# EAGLE design Adaptadora_AVR-Mega-U4_44pin (EAGLE 6.5.0)
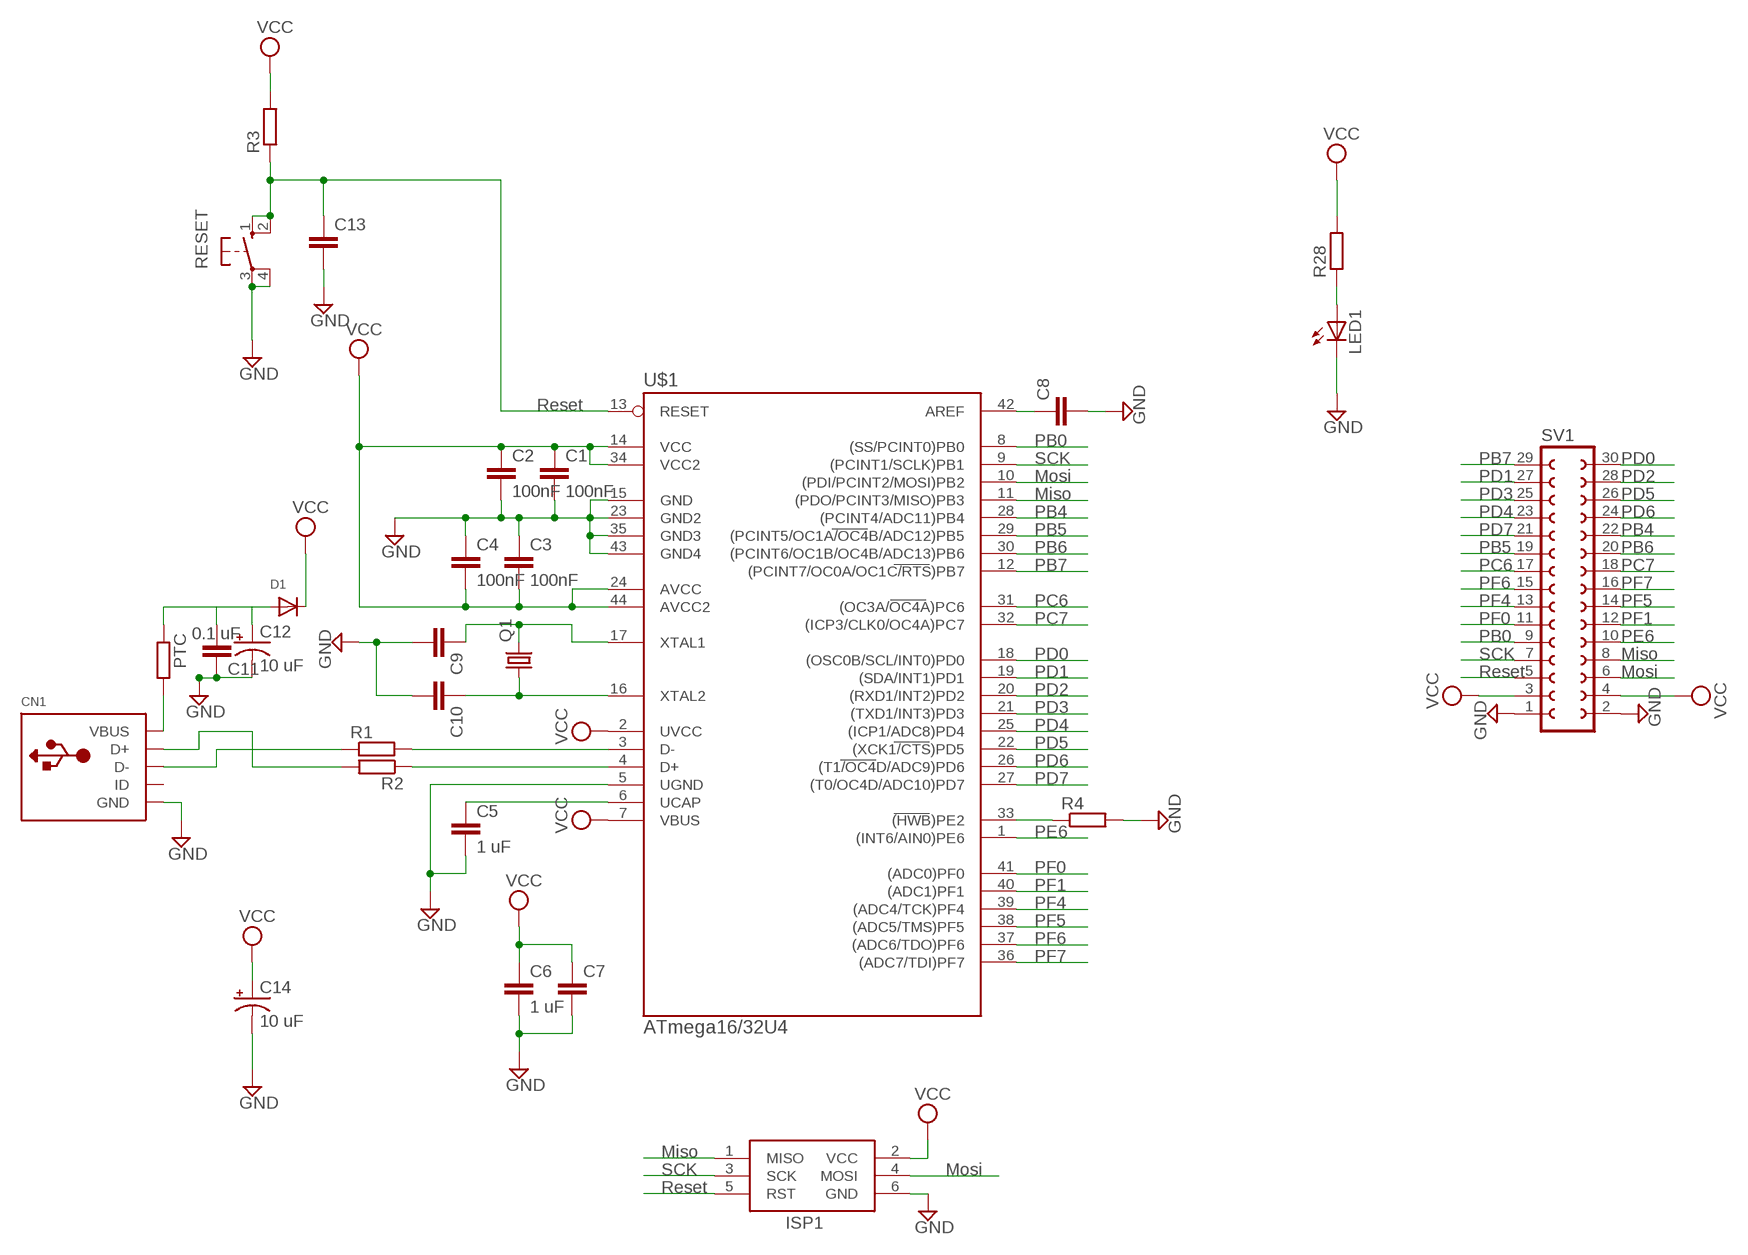
[diagram p0: schematic, sheet 1]

## Parts
C1  100nF  C-EUC1206  [C1206]
C2  100nF  C-EUC1206  [C1206]
C3  100nF  C-EUC1206  [C1206]
C4  100nF  C-EUC1206  [C1206]
C5  1 uF  C-EUC1206  [C1206]
C6  1 uF  C-EUC1206  [C1206]
C7  C-EUC1206  [C1206]
C8  C-EUC1206  [C1206]
C9  C-EUC1206  [C1206]
C10  C-EUC1206  [C1206]
C11  0.1 uF  C-EUC1206  [C1206]
C12  10 uF  CAP_POL1206  [EIA3216]
C13  C-EUC1206  [C1206]
C14  10 uF  CAP_POL1206  [EIA3216]
CN1  USBMINIB  [USB-MINIB]
D1  DIODESOD-123  [SOD-123]
ISP1  AVRISP-6  [AVRISP]
LED1  LEDCHIPLED_1206  [CHIPLED_1206]
PTC  R-EU_R1206  [R1206]
Q1  CRYSTALHC49UP  [HC49UP]
R1  R-EU_R1206  [R1206]
R2  R-EU_R1206  [R1206]
R3  R-EU_R1206  [R1206]
R4  R-EU_R1206  [R1206]
R28  R-EU_R1206  [R1206]
RESET  10-XX  [B3F-10XX]
SV1  FE15-2  [FE15-2]
U$1  ATmega16/32U4  ATMEGA32U4-AU  [TQFP44]

## Nets
GND: C1.2 C2.2 C3.1 C4.1 C5.2 C6.2 C7.2 C8.2 C9.2 C10.2 C11.2 C12.C(-) C13.2 C14.C(-) CN1.GND ISP1.6(GND) LED1.C R4.2 RESET.3(P) RESET.4(P1) SV1.1 SV1.2 U$1.5(UGND) U$1.15(GND) U$1.23(GND2) U$1.35(GND3) U$1.43(GND4)
MISO: ISP1.1(MISO) SV1.8 U$1.11((PDO/PCINT3/MISO)PB3)
MOSI: ISP1.4(MOSI) SV1.6 U$1.10((PDI/PCINT2/MOSI)PB2)
N$1: C9.1 Q1.2 U$1.17(XTAL1)
N$2: C10.1 Q1.1 U$1.16(XTAL2)
N$3: C5.1 U$1.6(UCAP)
N$6: R4.1 U$1.33((HWB)PE2)
N$8: R2.1 U$1.4(D+)
N$9: R1.2 U$1.3(D-)
N$10: CN1.D+ R2.2
N$11: CN1.D- R1.1
N$13: CN1.VBUS PTC.2
N$14: C11.1 C12.A(+) D1.A PTC.1
N$15: C8.1 U$1.42(AREF)
N$38: LED1.A R28.1
PB0: SV1.9 U$1.8((SS/PCINT0)PB0)
PB4: SV1.22 U$1.28((PCINT4/ADC11)PB4)
PB5: SV1.19 U$1.29((PCINT5/OC1A/OC4B/ADC12)PB5)
PB6: SV1.20 U$1.30((PCINT6/OC1B/OC4B/ADC13)PB6)
PB7: SV1.29 U$1.12((PCINT7/OC0A/OC1C/RTS)PB7)
PC6: SV1.17 U$1.31((OC3A/OC4A)PC6)
PC7: SV1.18 U$1.32((ICP3/CLK0/OC4A)PC7)
PD0: SV1.30 U$1.18((OSC0B/SCL/INT0)PD0)
PD1: SV1.27 U$1.19((SDA/INT1)PD1)
PD2: SV1.28 U$1.20((RXD1/INT2)PD2)
PD3: SV1.25 U$1.21((TXD1/INT3)PD3)
PD4: SV1.23 U$1.25((ICP1/ADC8)PD4)
PD5: SV1.26 U$1.22((XCK1/CTS)PD5)
PD6: SV1.24 U$1.26((T1/OC4D/ADC9)PD6)
PD7: SV1.21 U$1.27((T0/OC4D/ADC10)PD7)
PE6: SV1.10 U$1.1((INT6/AIN0)PE6)
PF0: SV1.11 U$1.41((ADC0)PF0)
PF1: SV1.12 U$1.40((ADC1)PF1)
PF4: SV1.13 U$1.39((ADC4/TCK)PF4)
PF5: SV1.14 U$1.38((ADC5/TMS)PF5)
PF6: SV1.15 U$1.37((ADC6/TDO)PF6)
PF7: SV1.16 U$1.36((ADC7/TDI)PF7)
RESET: C13.1 ISP1.5(RST) R3.1 RESET.1(S) RESET.2(S1) SV1.5 U$1.13(RESET)
SCK: ISP1.3(SCK) SV1.7 U$1.9((PCINT1/SCLK)PB1)
VCC: C1.1 C2.1 C3.2 C4.2 C6.1 C7.1 C14.A(+) D1.C ISP1.2(VCC) R3.2 R28.2 SV1.3 SV1.4 U$1.2(UVCC) U$1.7(VBUS) U$1.14(VCC) U$1.24(AVCC) U$1.34(VCC2) U$1.44(AVCC2)
Unconnected: CN1.ID

## Notes on the sheet
- Reset
- PB0
- SCK | PB7 | PD0
- Mosi | PD1 | PD2
- Miso | PD3 | PD5
- PB4 | PD4 | PD6
- PB5 | PD7 | PB4
- PB6 | PB5 | PB6
- PB7 | PC6 | PC7
- PF6 | PF7
- PC6 | PF4 | PF5
- PC7 | PF0 | PF1
- PB0 | PE6
- PD0 | SCK | Miso
- PD1 | Reset | Mosi
- PD2
- PD3
- PD4
- PD5
- PD6
- PD7
- PE6
- PF0
- PF1
- PF4
- PF5
- PF6
- PF7
- Miso
- SCK | Mosi
- Reset

## Library data of the parts
C1-C11 C13 = rcl:C-EU: CAPACITOR, European symbol
C12 C14 = SparkFun-Capacitors:CAP_POL: Capacitor Polarized These are standard SMD and PTH capacitors. Normally 10uF, 47uF, and 100uF in electrolytic and tantalum varieties. Always verify the external diameter of the through hole cap, it varies with capacity, voltage, and manufacturer. The EIA devices should be standard.
CN1 = adafruit:USB: USB Connectors USBMINIB - Surface Mount Female Mini-B USB Connector 4UConnector: 06564 By microbuilder.eu Thru-hole RA Female Mini-B USB Connector 4UConnector: 18732 By ladyada.net
D1 = adafruit:DIODE: Diode SMADIODE - SMA Surface Mount Package 20V 1A Schottky Diode Digikey: 641-1014-6-ND DO-1N4148 - Through Hole Small Current Diode SOD-123 20V 1 A (.5mV Vf) Schottky Diode - Digikey: MBRX120TPMSCT-ND SOD-323 10V 570mA (.38mV Vf, 3ns) Schottky Diode - Digikey: ZLLS410CT-ND SOD-523 30V 30mA Schottky Diode (RB751S-40TE61) - Digikey: RB751S-40TE61CT-ND SOT23-R/W - SOT23 Package (R = Solder Paste/Reflow Ovens, W = Hand-Soldering) BAT54Film 40V 300mA - Digikey: 497-7162-1-ND
ISP1 = adafruit:AVRISP: AVR ISP HEADER Standard 6 pin header for AVR programming
LED1 = adafruit:LED: LED OSRAM: - CHIPLED LG R971, LG N971, LY N971, LG Q971, LY Q971, LO R971, LY R971 LH N974, LH R974 LS Q976, LO Q976, LY Q976 LO Q996 - Hyper CHIPLED LW Q18S LB Q993, LB Q99A, LB R99A - SideLED LS A670, LO A670, LY A670, LG A670, LP A670 LB A673, LV A673, LT A673, LW A673 LH A674 LY A675 LS A676, LA A676, LO A676, LY A676, LW A676 LS A679, LY A679, LG A679 - Hyper Micro SIDELED® LS Y876, LA Y876, LO Y876, LY Y876 LT Y87S - SmartLED LW L88C, LW L88S LB L89C, LB L89S, LG L890 LS L89K, LO L89K, LY L89K LS L896, LA L896, LO L896, LY L896 - TOPLED LS T670, LO T670, LY T670, LG T670, LP T670 LSG T670, LSP T670, LSY T670, LOP T670, LYG T670 LG T671, LOG T671, LSG T671 LB T673, LV T673, LT T673, LW T673 LH T674 LS T676, LA T676, LO T676, LY T676, LB T676, LH T676, LSB T676, LW T676 LB T67C, LV T67C, LT T67C, LS T67K, LO T67K, LY T67K, LW E67C LS E67B, LA E67B, LO E67B, LY E67B, LB E67C, LV E67C, LT E67C LW T67C LS T679, LY T679, LG T679 LS T770, LO T770, LY T770, LG T770, LP T770 LB T773, LV T773, LT T773, LW T773 LH T774 LS E675, LA E675, LY E675, LS T675 LS T776, LA T776, LO T776, LY T776, LB T776 LHGB T686 LT T68C, LB T68C - Hyper Mini TOPLED® LB M676 - Mini TOPLED Santana® LG M470 LS M47K, LO M47K, LY M47K Source: http://www.osram.convergy.de/
PTC R1-R4 R28 = rcl:R-EU_: RESISTOR, European symbol
Q1 = crystal:CRYSTAL: CRYSTAL; OC_FARNELL: unknown; OC_NEWARK: unknown
RESET = switch-omron:10-XX: OMRON SWITCH; MPN: B3F-1000; OC_FARNELL: 176432; OC_NEWARK: 36M3542
SV1 = con-lsta:FE15-2: FEMALE HEADER; OC_FARNELL: unknown; OC_NEWARK: unknown
U$1 = mega32U4:ATMEGA32U4-AU

## Board
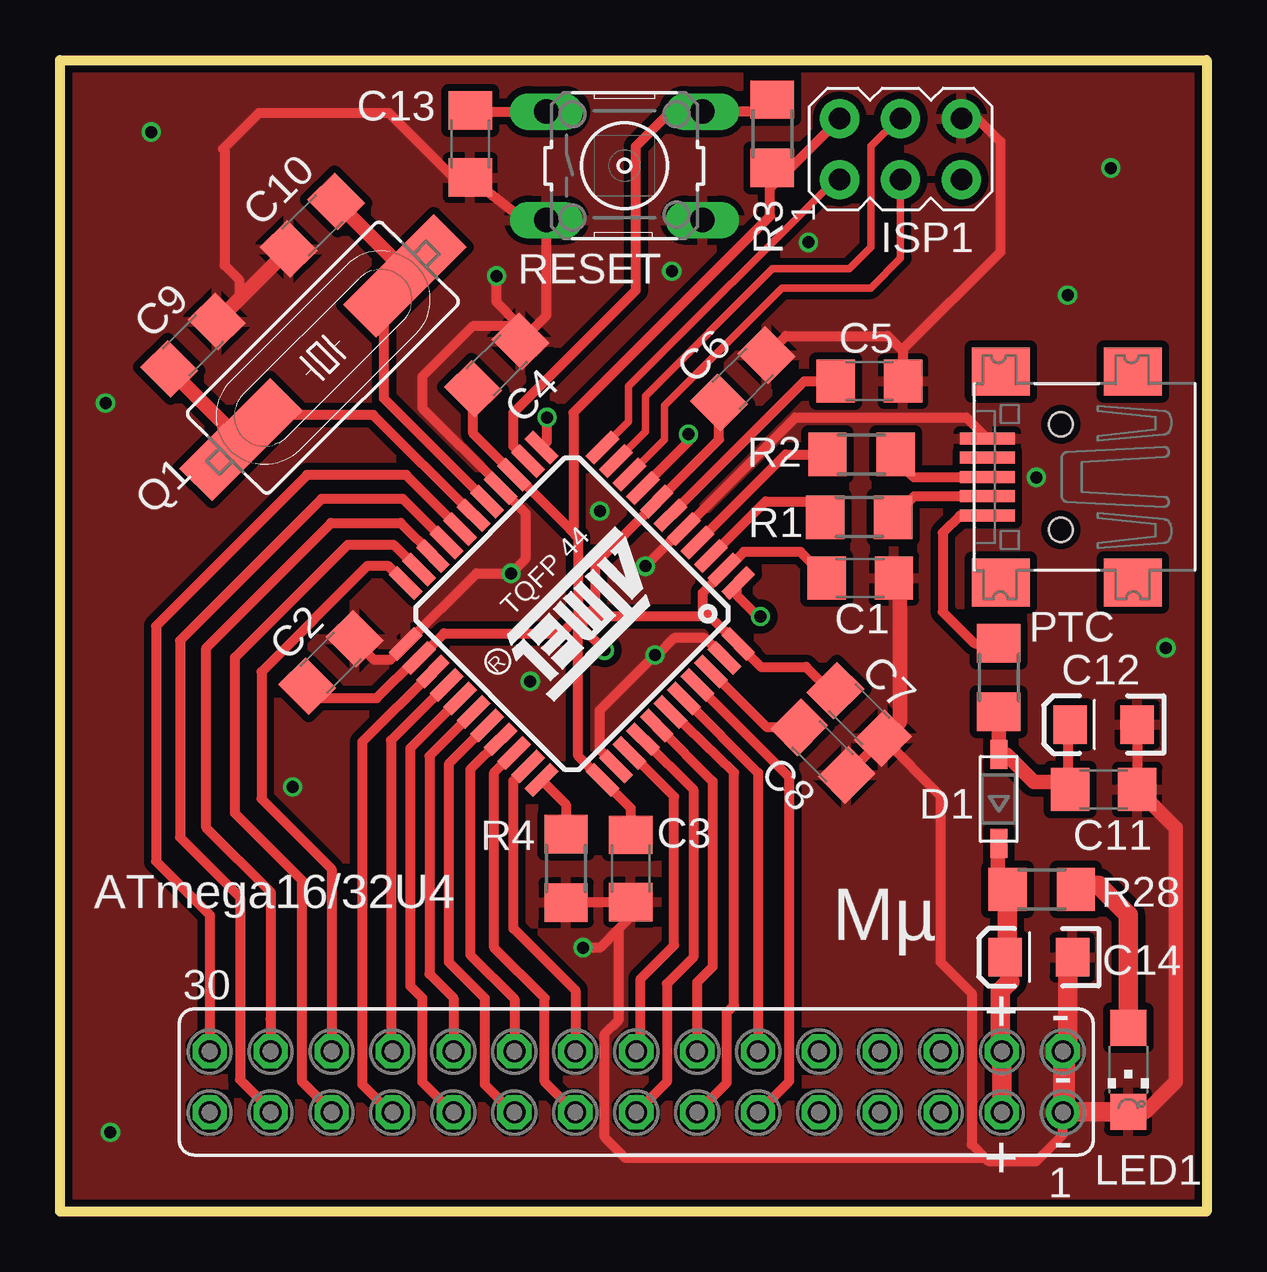
[diagram p1: board, top side]
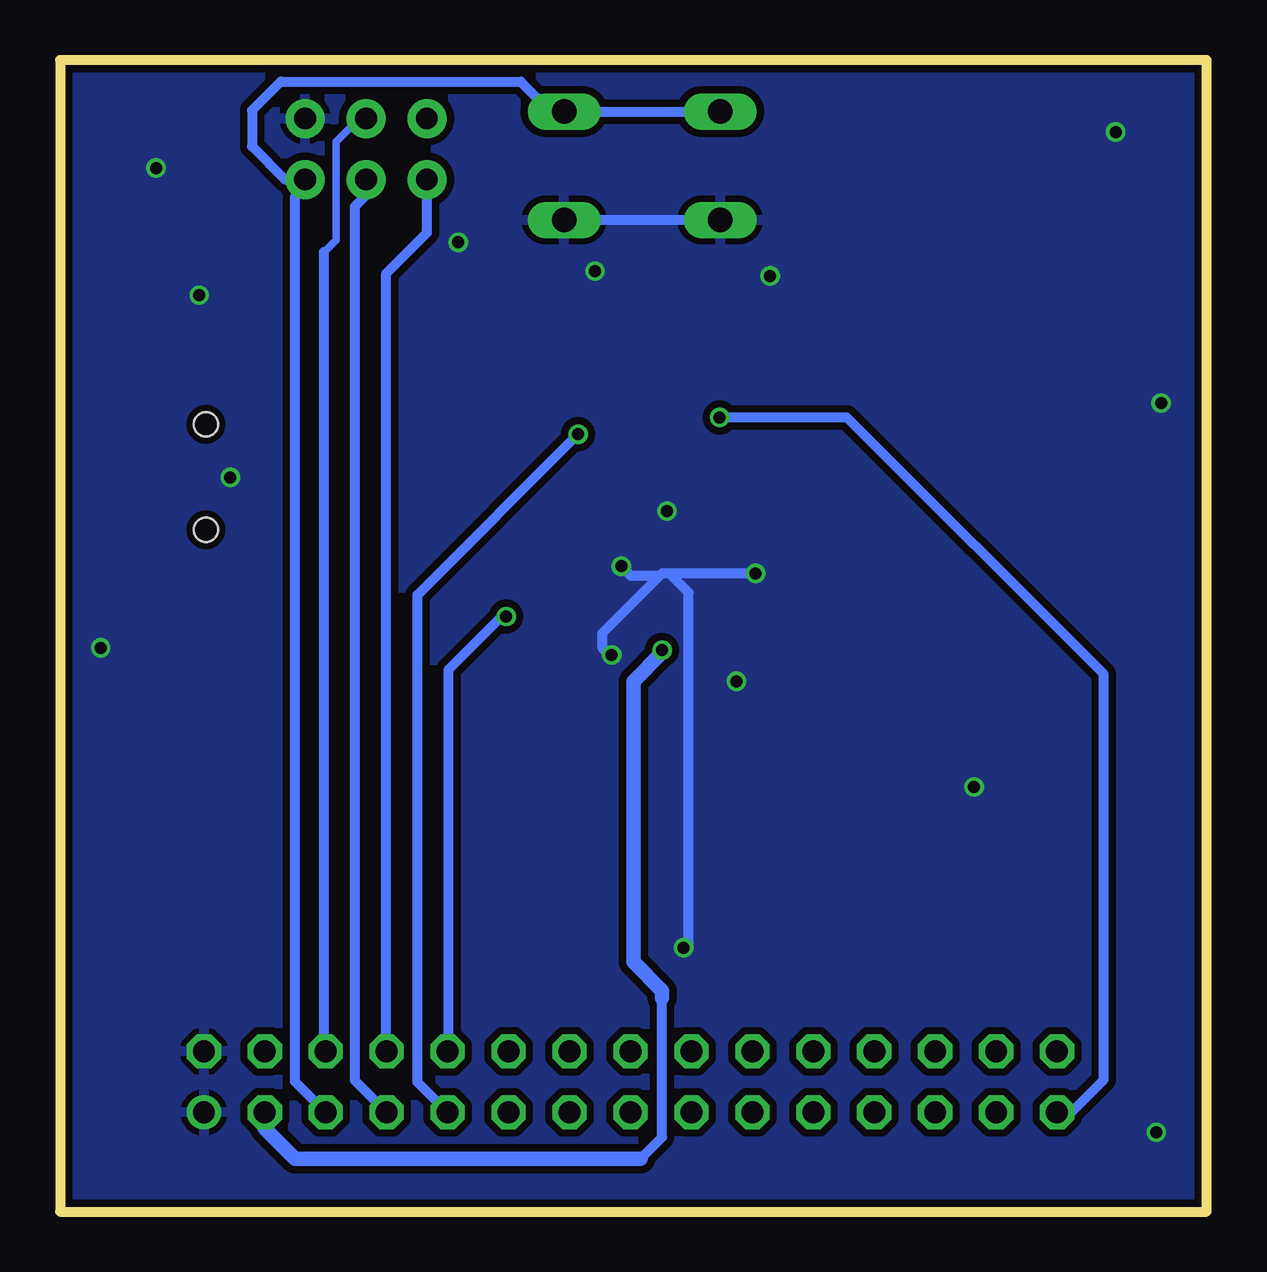
[diagram p2: board, bottom side, seen from below]

Size 47.8 x 48 mm. Coordinates in mm from the lower left corner, seen from the top.
Outline: 0,0 0,48 47.8,48 47.8,0 0,0
Copper layers (1*16): Top 0.035mm / dielectric 1.5mm / Bottom 0.035mm
Design rules "ITEADstudio_DRC": minimum track width 6mil, minimum drill 12mil, track to track 6mil, track to pad 6mil, pad to pad 6mil, via to via 6mil, smd to smd 0mil, copper to edge 10mil, drill to drill 10mil, minimum pad ring 10mil, minimum via ring 6mil, stop-mask expansion 2mil, vias tented up to drill 100mil, thermal gap 10mil

### Footprints (pad centres in the part's own frame; a part is rotated, then mirrored left to right if it is on the bottom)
C1206 = smd 1.6 x 1.8: 1 -1.4,0; 2 1.4,0
EIA3216 = smd 1.4 x 1.6: A 1.4,0; C -1.4,0
USB-MINIB = smd 0.5 x 2.308: D+ 0,4.064; D- -0.8,4.064; GND 1.6,4.064; ID 0.8,4.064; VBUS -1.6,4.064 | smd 2 x 2.4: GND1 -4.4,-2; GND2 -4.4,3.5; GND3 4.4,3.5; GND4 4.4,-2 | hole 1: -2.2,1; 2.2,1
SOD-123 = smd 1.2 x 0.7: A 1.85,0; C -1.85,0
AVRISP = drill 0.9 pad 1.626: 1 -1.27,2.54; 2 1.27,2.54; 3 -1.27,0; 4 1.27,0; 5 -1.27,-2.54; 6 1.27,-2.54
CHIPLED_1206 = smd 1.5 x 1.5: A 0,-1.75; C 0,1.75
R1206 = smd 1.6 x 1.803: 1 -1.422,0; 2 1.422,0
HC49UP = smd 5.334 x 1.93: 1 -4.826,0; 2 4.826,0
B3F-10XX = drill 1.016 long: 1 -3.251,2.261; 2 3.251,2.261; 3 -3.251,-2.261; 4 3.251,-2.261
FE15-2 = drill 0.914: 1 -17.78,1.27 | drill 0.914 octagon: 2 -17.78,-1.27; 3 -15.24,1.27; 4 -15.24,-1.27; 5 -12.7,1.27; 6 -12.7,-1.27; 7 -10.16,1.27; 8 -10.16,-1.27; 9 -7.62,1.27; 10 -7.62,-1.27; 11 -5.08,1.27; 12 -5.08,-1.27; 13 -2.54,1.27; 14 -2.54,-1.27; 15 0,1.27; 16 0,-1.27; 17 2.54,1.27; 18 2.54,-1.27; 19 5.08,1.27; 20 5.08,-1.27; 21 7.62,1.27; 22 7.62,-1.27; 23 10.16,1.27; 24 10.16,-1.27; 25 12.7,1.27; 26 12.7,-1.27; 27 15.24,1.27; 28 15.24,-1.27; 29 17.78,1.27; 30 17.78,-1.27
TQFP44 = smd 1.5 x 0.5: 1 -5.8,4; 2 -5.8,3.2; 3 -5.8,2.4; 4 -5.8,1.6; 5 -5.8,0.8; 6 -5.8,0; 7 -5.8,-0.8; 8 -5.8,-1.6; 9 -5.8,-2.4; 10 -5.8,-3.2; 11 -5.8,-4; 23 5.8,-4; 24 5.8,-3.2; 25 5.8,-2.4; 26 5.8,-1.6; 27 5.8,-0.8; 28 5.8,0; 29 5.8,0.8; 30 5.8,1.6; 31 5.8,2.4; 32 5.8,3.2; 33 5.8,4 | smd 0.5 x 1.5: 12 -4,-5.8; 13 -3.2,-5.8; 14 -2.4,-5.8; 15 -1.6,-5.8; 16 -0.8,-5.8; 17 0,-5.8; 18 0.8,-5.8; 19 1.6,-5.8; 20 2.4,-5.8; 21 3.2,-5.8; 22 4,-5.8; 34 4,5.8; 35 3.2,5.8; 36 2.4,5.8; 37 1.6,5.8; 38 0.8,5.8; 39 0,5.8; 40 -0.8,5.8; 41 -1.6,5.8; 42 -2.4,5.8; 43 -3.2,5.8; 44 -4,5.8

### Placement (x,y rotation side)
C1  33.36,26.41 0 top
C2  11.29,22.88 45 top
C3  23.79,14.3 90 top
C4  18.21,35.28 225 top
C5  33.74,34.61 0 top
C6  28.46,34.71 45 top
C7  33.31,20.72 315 top
C8  31.8,19.19 315 top
C9  5.54,36.11 45 top
C10  10.52,41.11 225 top
C11  43.5,17.59 0 top
C12  43.5,20.3 180 top
C13  17.1,44.5 270 top
C14  40.8,10.6 180 top
CN1  42.72,30.62 90 top
D1  39.13,17.2 90 top
ISP1  35.04,44.29 90 top
LED1  44.53,5.91 180 top
PTC  39.13,22.26 90 top
Q1  10.96,35.59 225 top
R1  33.31,28.94 180 top
R2  33.41,31.56 0 top
R3  29.69,44.92 270 top
R4  21.09,14.3 270 top
R28  40.92,13.43 180 top
RESET  23.53,43.59 0 top
SV1  24.02,5.4 180 top
U$1  21.34,24.92 225 top

### Tracks (layer width: path | path; a pad name or v marks a point on that pad's centre or on a via)
GND  (via drill 0.5)
  Top 0.406: ISP1.6 37.64,45.5 38.3,45.5 39.2,44.6 39.2,40 35.14,35.94 35.14,35.86 | 19.1,37 19.2,36.9 C4.1 20.28,37.35 RESET.3 19.37,41.33 C13.2 16.4,43.1 13.7,45.8 8.3,45.8 6.8,44.3 6.86,44.24 6.86,39.45 7.46,38.84 7.46,38.03 | R4.2 23.77,12.88 C3.1 23.79,12.29 23.3,11.8 | C8.2 34.3,19.71 C7.2 36.7,17.33 36.7,10.4 38,9.1 38,2.8 38.55,2.25 | CN1.GND 37.78,33.1 30.65,33.1 U$1.5 25.96,28.46 v24.4,26.9 | 38.55,2.25 38.7,2.1 40.7,2.1 41.8,3.2 SV1.1 | U$1.35 22.5,19.23 22.5,20.9 v24.8,23.2 24.9,23.2 25.6,23.9 26.89,23.9 U$1.43 | 38.55,2.25 23.55,2.25 22.7,3.1 22.7,7.4 23.3,8 23.3,11.8 | 23.3,11.8 22.5,11 v21.8,11 | C2.2 12.28,23.82 13.1,23 13.76,23 U$1.23 17.36,26.6 v18.8,26.6 19.4,27.2 19.4,29.12 U$1.15 18.37,30.23 15.1,33.5 15.1,34.8 17.2,36.9 19,36.9 19.1,37 | 19.1,37 18.2,37.9 v18.2,39 | C6.2 30.25,36.5 34.5,36.5 35.14,35.86 | 35.14,35.86 C5.2 | C12.C C11.2 | C14.C 42,10.6 42,9.7
  Top 0.61: 44.82,17.67 C11.2 46.5,15.99 46.5,5.4 45.26,4.16 LED1.C | C1.2 35,26.17 35,20.4 34.33,19.73 C7.2 | C9.2 7.46,38.03 9.53,40.1 C10.2
  Top 0.813: SV1.2 SV1.1 41.83,4.16 | SV1.2 41.9,6.57 41.9,4.1 41.96,4.16 LED1.C | SV1.2 42,6.87 42,9.7
  Bottom 0.406: RESET.3 RESET.4 | v18.8,26.6 22.4,26.6 | 22.4,26.6 22.7,26.6 22.8,26.5 | 22.8,26.5 25.2,24.1 25.2,23.5 24.9,23.2 v24.8,23.2 | 22.8,26.5 24,26.5 v24.4,26.9 | v21.8,11 21.6,11.2 21.6,25.8 22.4,26.6
  other vias: 9.7,17.7 3.8,45 1.9,33.7 43.8,43.5 42,38.2 25.5,39.2 2.1,3.3 46.1,23.5 19.6,22.1 40.7,30.6 31.2,40.4 22.5,29.2
  pour Top (isolate 0.305): 0.4,47.6 47.4,47.6 47.4,0.4 0.4,0.4
  pour Bottom (isolate 0.305): 0.4,47.6 47.4,47.6 47.4,0.4 0.4,0.4
MISO
  Top 0.305: U$1.11 23.7,32.94 23.7,34.4 32.32,43.02 ISP1.1
  Bottom 0.406: SV1.8 34.2,6.69 34.2,39.1 32.5,40.8 ISP1.1
MOSI
  Top 0.305: ISP1.4 34.96,45.56 33.8,44.4 33.8,40.2 32.9,39.3 29.7,39.3 24.4,34 24.4,32.51 U$1.10
  Bottom 0.305: 36.8,40 36.3,40.5 36.3,44.6 35.34,45.56 ISP1.4
  Bottom 0.406: SV1.6 36.8,6.75 36.8,40
N$1
  Top 0.406: U$1.17 13.06,33.2 9,33.2 7.98,32.18 Q1.2
  Top 0.61: C9.1 7.49,32.18 Q1.2
N$2
  Top 0.406: U$1.16 13.5,33.89 13.5,37.7 14.37,38.57 Q1.1
  Top 0.61: C10.1 14.37,39.24 Q1.1
N$3
  Top 0.406: U$1.6 31.03,34.61 C5.1
N$6
  Top 0.406: U$1.33 21.09,16.97 R4.1
N$8
  Top 0.406: U$1.4 30.24,31.56 R2.1
N$9
  Top 0.406: U$1.3 29.41,29.6 31.8,29.6 31.89,29.51 R1.2
N$10
  Top 0.406: CN1.D+ 38.64,30.6 35.6,30.6 34.83,31.37 R2.2
N$11
  Top 0.406: R1.1 35.61,29.82 CN1.D-
N$13
  Top 0.406: CN1.VBUS 38.64,29 37.5,29 36.8,28.3 36.8,25 38.12,23.68 PTC.2
N$14
  Top 0.406: C12.A 42.02,20.3 42.02,18.13
  Top 0.61: PTC.1 D1.A 39.45,19.05 40.6,17.9 41.79,17.9 | C11.1 41.79,17.9 | 41.79,17.9 42.02,18.13
N$15
  Top 0.406: C8.1 29.47,20.18 U$1.42
N$38
  Top 0.813: R28.1 42.51,13.6 43.3,13.6 44.53,12.37 LED1.A
PB0  (via drill 0.5)
  Top 0.305: U$1.8 24.25,30.15
  Top 0.406: 24.25,30.15 26.2,32.1 v26.2,32.4
  Bottom 0.406: SV1.9 32.9,5.39 32.9,25.7 v26.2,32.4
PB4
  Top 0.406: U$1.28 15.4,18.98 15.4,9.9 16.4,8.9 SV1.22
PB5
  Top 0.406: U$1.29 16.2,18.65 16.2,10.4 17.7,8.9 17.7,5.3 18.87,4.13 SV1.19
PB6
  Top 0.406: U$1.30 17.1,18.42 17.1,10.7 18.94,8.86 SV1.20
PB7  (via drill 0.5)
  Top 0.406: U$1.12 20.3,32.08 v20.3,33.1
  Bottom 0.406: SV1.29 6.11,4 5.8,4 4.3,5.5 4.3,22.4 15,33.1 v20.3,33.1
PC6
  Top 0.406: SV1.17 20.2,5.41 20.2,8.9 18.1,11 18.1,18.3 18.92,19.12 U$1.31
PC7
  Top 0.406: U$1.32 18.9,17.95 18.9,11.8 21.48,9.22 SV1.18
PD0
  Top 0.406: U$1.18 14.43,30.7 10.3,30.7 4,24.4 4,14.6 6.24,12.36 SV1.30
PD1
  Top 0.406: SV1.27 8.78,4.22 7.5,5.5 7.5,13.1 5,15.6 5,23.8 10.9,29.7 14.3,29.7 14.5,29.5 U$1.19
PD2
  Top 0.406: SV1.28 8.78,8.02 8.8,8.04 8.8,13.3 6.1,16 6.1,23.5 11.3,28.7 14.2,28.7 15.54,27.36 U$1.20
PD3
  Top 0.406: SV1.25 11.32,4.18 10.1,5.4 10.1,13.8 7.3,16.6 7.3,23.1 12,27.8 13.9,27.8 14.94,26.76 U$1.21
PD4
  Top 0.406: U$1.25 12.6,19.57 12.6,5.3 13.77,4.13 SV1.23
PD5
  Top 0.406: U$1.22 13.8,26.8 13.7,26.9 12.8,26.9 8.4,22.5 8.4,17.2 11.32,14.28 SV1.26
PD6
  Top 0.406: U$1.26 13.8,19.64 13.8,7.3 13.86,7.24 SV1.24
PD7
  Top 0.406: U$1.27 14.6,19.31 14.6,9.4 15.1,8.9 15.1,5.4 16.37,4.13 SV1.21
PE6  (via drill 0.5)
  Top 0.406: U$1.1 28.2,26.12 28.2,25.7 29.1,24.8 v29.2,24.8
  Bottom 0.406: SV1.10 31.6,6.71 31.6,22.6 29.4,24.8 v29.2,24.8
PF0
  Top 0.406: SV1.11 30.4,5.43 30.4,18.1 26.57,21.93 U$1.41
PF1
  Top 0.406: U$1.40 29.1,18.29 SV1.12
PF4
  Top 0.406: SV1.13 27.8,5.37 27.8,8.3 28.1,8.6 28.1,18.3 25.48,20.82 U$1.39
PF5
  Top 0.406: U$1.38 27.2,17.93 27.2,10.2 26.56,9.56 SV1.14
PF6
  Top 0.406: U$1.37 26.4,17.6 26.4,10.6 25.3,9.5 25.3,5.4 SV1.15
PF7
  Top 0.406: SV1.16 24.2,6.85 24.2,9.7 25.6,11.1 25.6,17.3 23.78,19.12 U$1.36
RESET
  Top 0.406: U$1.13 18.9,31.89 18.9,33.3 24,38.4 24,44.4 25.45,45.85 RESET.2 29.18,45.85 29.67,46.34 R3.1 | C13.1 17.65,45.85 RESET.1
  Bottom 0.406: 27.05,45.85 RESET.2 | RESET.2 RESET.1 | RESET.2 27.4,45.85 27.4,45.9 28.6,47.1 38.6,47.1 39.8,45.9 39.8,44.4 38.42,43.02 ISP1.5 37.58,42.72 38,42.3 38,5.41 SV1.5
SCK
  Top 0.305: U$1.9 25.2,32.17 25.2,33.6 30.1,38.5 33.8,38.5 35.04,39.74 ISP1.3
  Bottom 0.406: SV1.7 35.5,5.45 35.5,41.9 35.04,42.36 ISP1.3
VCC  (via drill 0.5)
  Top 0.406: C4.2 17.22,32.43 U$1.14 18.98,30.72 21.3,28.4 | ISP1.2 30.44,43.5 | 30.44,43.5 R3.2 | 30.44,43.5 29.6,42.66 29.6,41.5 21.4,33.3 21.4,28.5 21.3,28.4 | C3.2 23.79,16.81 U$1.34 21.6,19 21.6,24.8 | C1.1 30.87,27.5 28.5,27.5 27.76,26.76 U$1.2 | C7.1 32.09,21.71 31.1,22.7 29.22,22.7 U$1.44 28.25,23.65 27.1,24.8 | U$1.2 27.66,26.76 | 27.1,24.8 21.9,24.8 | 21.9,24.8 21.8,24.8 | 21.8,24.8 21.6,24.8 | 21.3,28.4 21.6,28.1 21.6,24.8 | 21.9,24.8 22.3,25.2 22.3,27 24.88,29.58 U$1.7 27.47,32.18 C6.1 | 21.6,24.8 20.9,24.1 16,24.1 U$1.24 14.88,23.08 13.2,21.4 10.79,21.4 C2.1 | v22.7,23.4 21.8,24.3 21.8,24.8 | 27.1,24.8 26.8,25.1 26.8,25.8 27.7,26.7 U$1.2 | 39.6,9.6 39.4,9.6 C14.A 39.5,10.6 39.5,10.5
  Top 0.61: D1.C 39.1,15.32 39.1,13.9 39.5,13.5 R28.2
  Top 0.813: SV1.3 SV1.4 39.2,6.73 39.2,9.2 39.6,9.6 | 39.5,10.2 39.5,10.5 R28.2
  Bottom 0.406: 23.6,2.2 22.7,3.1 22.7,8.9
  Bottom 0.61: 23.6,2.2 38,2.2 39.26,3.46 SV1.3 | 22.7,8.9 22.7,9.2 23.9,10.4 23.9,22.1 22.7,23.3 v22.7,23.4

### Text on the board
tNames: Mµ | + | - | - | - | +